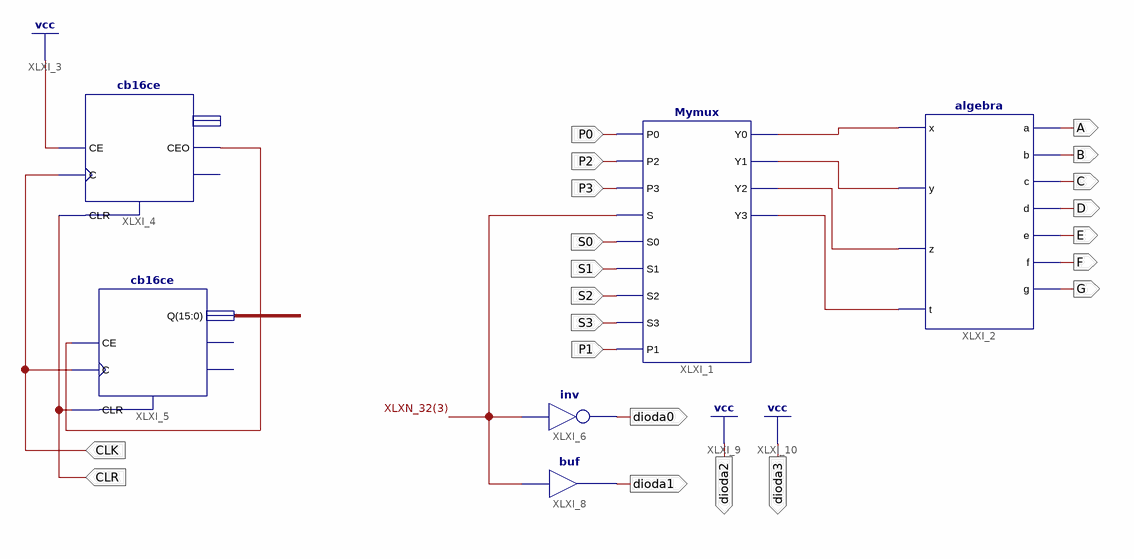
[diagram p0: schematic sheet 1]
// Xilinx ISE schematic dvecisla.sch (spartan3e) as structural Verilog: 6 symbols, 21 ports
module dvecisla (
  input  CLK,
  input  CLR,
  input  P0,
  input  P2,
  input  P3,
  input  P1,
  input  S0,
  input  S1,
  input  S2,
  input  S3,
  output A,
  output B,
  output C,
  output D,
  output E,
  output F,
  output G,
  output dioda0,
  output dioda1,
  output dioda2,
  output dioda3
);

  wire XLXN_2, XLXN_12, XLXN_13, XLXN_14, XLXN_15;
  wire [15:0] XLXN_32;

  Mymux XLXI_1 (
    .S0(S0), .P0(P0), .S(XLXN_32[3]), .S1(S1), .S2(S2), .P2(P2), .S3(S3), .P3(P3), .P1(P1), .Y0(XLXN_12),
    .Y1(XLXN_13), .Y3(XLXN_15), .Y2(XLXN_14));
  algebra XLXI_2 (.x(XLXN_12), .y(XLXN_13), .z(XLXN_14), .t(XLXN_15), .a(A), .b(B), .c(C), .d(D), .e(E), .f(F), .g(G));
  cb16ce XLXI_4 (.C(CLK), .CE(1'b1), .CLR(CLR), .CEO(XLXN_2));  // open: Q, TC
  cb16ce XLXI_5 (.C(CLK), .CE(XLXN_2), .CLR(CLR), .Q(XLXN_32));  // open: CEO, TC
  not XLXI_6 (dioda0, XLXN_32[3]);
  buf XLXI_8 (dioda1, XLXN_32[3]);

  assign dioda2 = 1'b1;
  assign dioda3 = 1'b1;
endmodule
